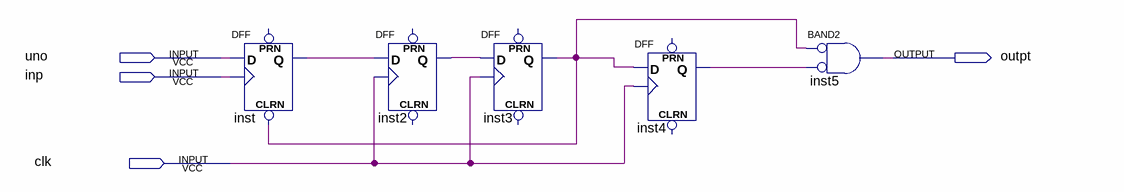
[diagram p0: schematic sheet]
// Quartus schematic circuito2.bdf as structural Verilog: 5 symbols, 4 pins
module circuito2 (
  input  uno,
  input  inp,
  input  clk,
  output outpt
);

  wire inst2_q, inst3_q, inst4_q, inst_q;

  DFF inst (.CLRN(inst3_q), .CLK(inp), .D(uno), .Q(inst_q));  // open: PRN
  DFF inst2 (.CLK(clk), .D(inst_q), .Q(inst2_q));  // open: CLRN, PRN
  DFF inst3 (.CLK(clk), .D(inst2_q), .Q(inst3_q));  // open: CLRN, PRN
  DFF inst4 (.CLK(clk), .D(inst3_q), .Q(inst4_q));  // open: CLRN, PRN
  and inst5 (outpt, ~inst3_q, ~inst4_q);  // BAND2
endmodule
